# EAGLE design ftdi-485 (EAGLE 6.1)
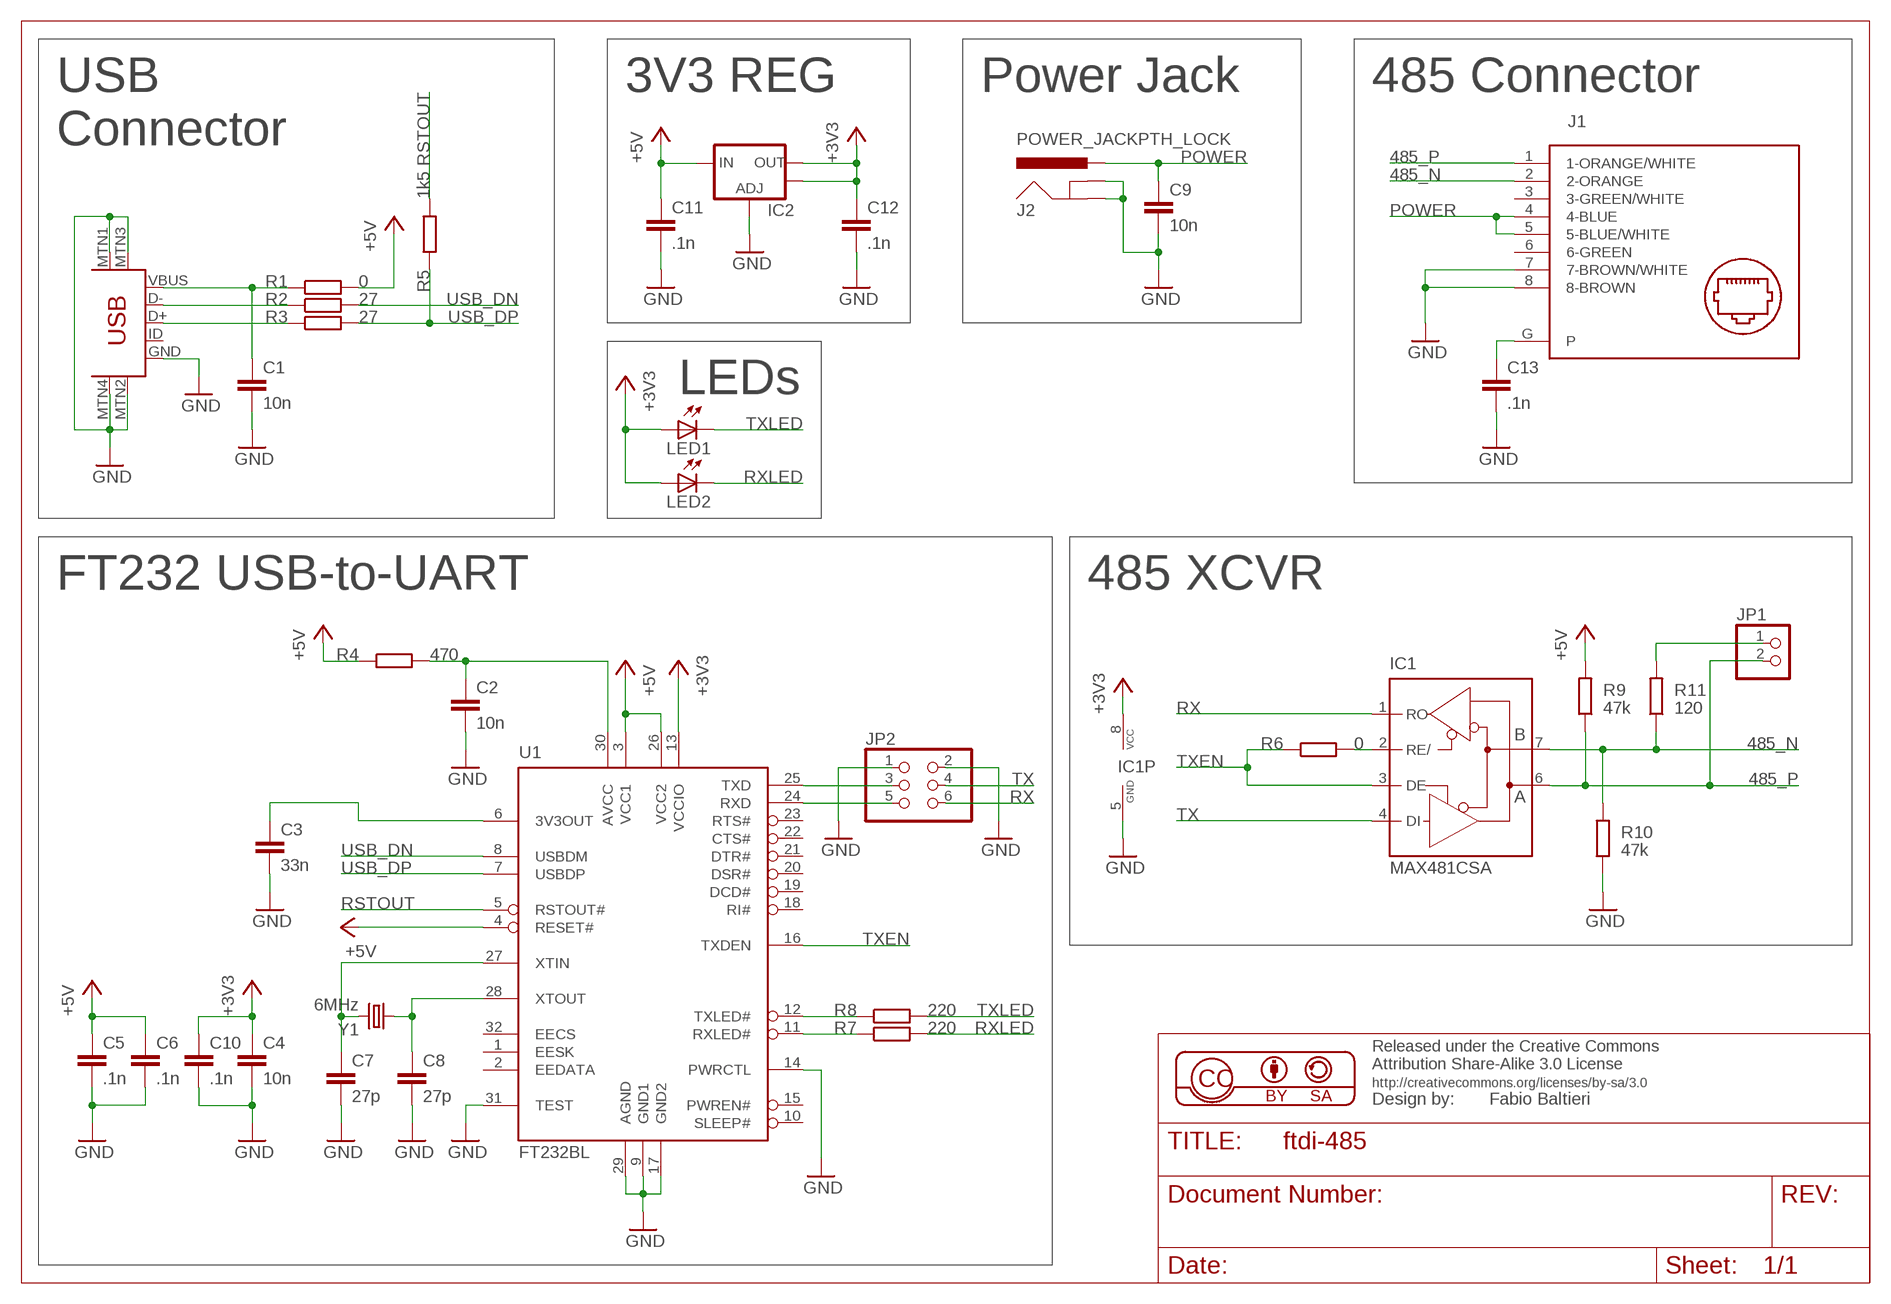
[diagram p0: schematic, sheet 1]

## Parts
C1  10n  C-EUC0805  [C0805]
C2  10n  C-EUC0805  [C0805]
C3  33n  C-EUC0805  [C0805]
C4  10n  C-EUC0805  [C0805]
C5  .1n  C-EUC0805  [C0805]
C6  .1n  C-EUC0805  [C0805]
C7  27p  C-EUC0805  [C0805]
C8  27p  C-EUC0805  [C0805]
C9  10n  C-EUC0805  [C0805]
C10  .1n  C-EUC0805  [C0805]
C11  .1n  C-EUC0805  [C0805]
C12  .1n  C-EUC0805  [C0805]
C13  .1n  C-EUC0805  [C0805]
IC1  MAX481CSA  [SO08]
IC2  V_REG_LM1117SOT223  [SOT223]
J1  NE8FAH  [NE8FAH]
J2  POWER_JACKPTH_LOCK  [POWER_JACK_PTH_LOCK]
JP1  PINHD-1X2  [1X02]
JP2  PINHD-2X3  [2X03]
LED1  LEDCHIP-LED0805  [CHIP-LED0805]
LED2  LEDCHIP-LED0805  [CHIP-LED0805]
R1  0  R-EU_R0603  [R0603]
R2  27  R-EU_R0603  [R0603]
R3  27  R-EU_R0603  [R0603]
R4  470  R-EU_R0603  [R0603]
R5  1k5  R-EU_R0603  [R0603]
R6  0  R-EU_R0603  [R0603]
R7  220  R-EU_R0603  [R0603]
R8  220  R-EU_R0603  [R0603]
R9  47k  R-EU_R0603  [R0603]
R10  47k  R-EU_R0603  [R0603]
R11  120  R-EU_R0603  [R0603]
U1  FT232BL  [LQFP32]
U$2  USB-MINIB-5PIN  [USB-MINIB]
Y1  6MHz  CRYSTALHC49UV  [HC49U-V]

## Nets
485_N: IC1.7(B) J1.2(2-ORANGE) R10.2 R11.1
485_P: IC1.6(A) J1.1(1-ORANGE/WHITE) JP1.2 R9.1
+3V3: C4.1 C10.1 C12.1 IC1.8(VCC) IC2.2(OUT) IC2.4(OUT) LED1.A LED2.A U1.13(VCCIO)
+5V: C5.1 C6.1 C11.1 IC2.3(IN) R1.2 R4.1 R9.2 U1.3(VCC1) U1.4(RESET#) U1.26(VCC2)
GND: C1.2 C2.2 C3.2 C4.2 C5.2 C6.2 C7.2 C8.2 C9.2 C10.2 C11.2 C12.2 C13.2 IC1.5(GND) IC2.1(ADJ) J1.7(7-BROWN/WHITE) J1.8(8-BROWN) J2.GND J2.GNDBREAK JP2.1 JP2.2 R10.1 U1.9(GND1) U1.14(PWRCTL) U1.17(GND2) U1.29(AGND) U1.31(TEST) U$2.GND U$2.MTN1(MTN2) U$2.MTN2(MTN3) U$2.MTN3(MTN1) U$2.MTN4
N$1: C1.1 R1.1 U$2.VBUS
N$2: R2.1 U$2.D-
N$3: R3.1 U$2.D+
N$4: R8.1 U1.12(TXLED#)
N$5: C2.1 R4.2 U1.30(AVCC)
N$6: C3.1 U1.6(3V3OUT)
N$7: C7.1 U1.27(XTIN) Y1.2
N$8: C8.1 U1.28(XTOUT) Y1.1
N$9: R7.1 U1.11(RXLED#)
N$10: IC1.2(RE/) R6.2
N$11: JP1.1 R11.2
N$12: JP2.5 U1.24(RXD)
N$13: JP2.3 U1.25(TXD)
N$14: C13.1 J1.G(P)
POWER: C9.1 J1.4(4-BLUE) J1.5(5-BLUE/WHITE) J2.PWR
RSTOUT: R5.2 U1.5(RSTOUT#)
RX: IC1.1(RO) JP2.6
RXLED: LED2.C R7.2
TX: IC1.4(DI) JP2.4
TXEN: IC1.3(DE) R6.1 U1.16(TXDEN)
TXLED: LED1.C R8.2
USB_DN: R2.2 U1.8(USBDM)
USB_DP: R3.2 R5.1 U1.7(USBDP)
Unconnected: J1.3(3-GREEN/WHITE) J1.6(6-GREEN) U1.1(EESK) U1.2(EEDATA) U1.10(SLEEP#) U1.15(PWREN#) U1.18(RI#) U1.19(DCD#) U1.20(DSR#) U1.21(DTR#) U1.22(CTS#) U1.23(RTS#) U1.32(EECS) U$2.ID

## Notes on the sheet
- USB | 3V3 REG | Power Jack | 485 Connector
- Connector
- LEDs
- FT232 USB-to-UART | 485 XCVR

## Library data of the parts
C1-C13 = rcl:C-EU: CAPACITOR, European symbol
IC1 = maxim:MAX481CSA: RS485 TRANSEIVER
IC2 = sparkfun:V_REG_LM1117: Voltage Regulator LM1117 Standard adjustable voltage regulator but in SMD form. Spark Fun Electronics SKU : COM-00595
J1 = audio:NE8FAH: Ethercon NE8FAH Horizonal PCB mount RJ45 receptacle, A-Series cutout with latch lock, max. panel thickness 3 mm
J2 = sparkfun:POWER_JACK: Power Jack This is the standard 5.5mm barrel jack for power. The PTH is the most common, proven, reliable, footprint. All others are experimental. The Slot footprint only works if the mill layer is transmitted to the PCB fab house so be warned. Spark Fun Electronics SKU : PRT-00119. Mating wall wart : TOL-00298 (and others)
JP1 = pinhead:PINHD-1X2: PIN HEADER
JP2 = pinhead:PINHD-2X3: PIN HEADER
LED1 LED2 = led:LED: LED OSRAM: - CHIPLED LG R971, LG N971, LY N971, LG Q971, LY Q971, LO R971, LY R971 LH N974, LH R974 LS Q976, LO Q976, LY Q976 LO Q996 - Hyper CHIPLED LW Q18S LB Q993, LB Q99A, LB R99A - SideLED LS A670, LO A670, LY A670, LG A670, LP A670 LB A673, LV A673, LT A673, LW A673 LH A674 LY A675 LS A676, LA A676, LO A676, LY A676, LW A676 LS A679, LY A679, LG A679 - Hyper Micro SIDELED® LS Y876, LA Y876, LO Y876, LY Y876 LT Y87S - SmartLED LW L88C, LW L88S LB L89C, LB L89S, LG L890 LS L89K, LO L89K, LY L89K LS L896, LA L896, LO L896, LY L896 - TOPLED LS T670, LO T670, LY T670, LG T670, LP T670 LSG T670, LSP T670, LSY T670, LOP T670, LYG T670 LG T671, LOG T671, LSG T671 LB T673, LV T673, LT T673, LW T673 LH T674 LS T676, LA T676, LO T676, LY T676, LB T676, LH T676, LSB T676, LW T676 LB T67C, LV T67C, LT T67C, LS T67K, LO T67K, LY T67K, LW E67C LS E67B, LA E67B, LO E67B, LY E67B, LB E67C, LV E67C, LT E67C LW T67C LS T679, LY T679, LG T679 LS T770, LO T770, LY T770, LG T770, LP T770 LB T773, LV T773, LT T773, LW T773 LH T774 LS E675, LA E675, LY E675, LS T675 LS T776, LA T776, LO T776, LY T776, LB T776 LHGB T686 LT T68C, LB T68C - Hyper Mini TOPLED® LB M676 - Mini TOPLED Santana® LG M470 LS M47K, LO M47K, LY M47K Source: http://www.osram.convergy.de LUXEON: - LUMILED® LXK2-PW12-R00, LXK2-PW12-S00, LXK2-PW14-U00, LXK2-PW14-V00 LXK2-PM12-R00, LXK2-PM12-S00, LXK2-PM14-U00 LXK2-PE12-Q00, LXK2-PE12-R00, LXK2-PE12-S00, LXK2-PE14-T00, LXK2-PE14-U00 LXK2-PB12-K00, LXK2-PB12-L00, LXK2-PB12-M00, LXK2-PB14-N00, LXK2-PB14-P00, LXK2-PB14-Q00 LXK2-PR12-L00, LXK2-PR12-M00, LXK2-PR14-Q00, LXK2-PR14-R00 LXK2-PD12-Q00, LXK2-PD12-R00, LXK2-PD12-S00 LXK2-PH12-R00, LXK2-PH12-S00 LXK2-PL12-P00, LXK2-PL12-Q00, LXK2-PL12-R00 Source: www.luxeon.com KINGBRIGHT: KA-3528ASYC Source: www.kingbright.com
R1-R11 = rcl:R-EU_: RESISTOR, European symbol
U1 = ftdichip-4:FT232BL: USB UART 2nd Generation USB UART (USB <-> Serial) Controller
U$2 = sparkfun:USB-MINIB: Mini-USB "B" connector with 5th pin broken out. Created new symbol breaking out 5th "ID" pin in mini/micro USB connector spec. See: http://en.wikipedia.org/wiki/Mini_usb#Cables. Uses same footprint as 4-pin symbol. Also added pins to connect to mounting / shield pads if required (probably not generally needed as signals aren't shielded once they leave the connector).
Y1 = sparkfun:CRYSTAL: Crystals Various standard crystals. Proven footprints. Spark Fun Electronics SKU : COM-00534

## Board
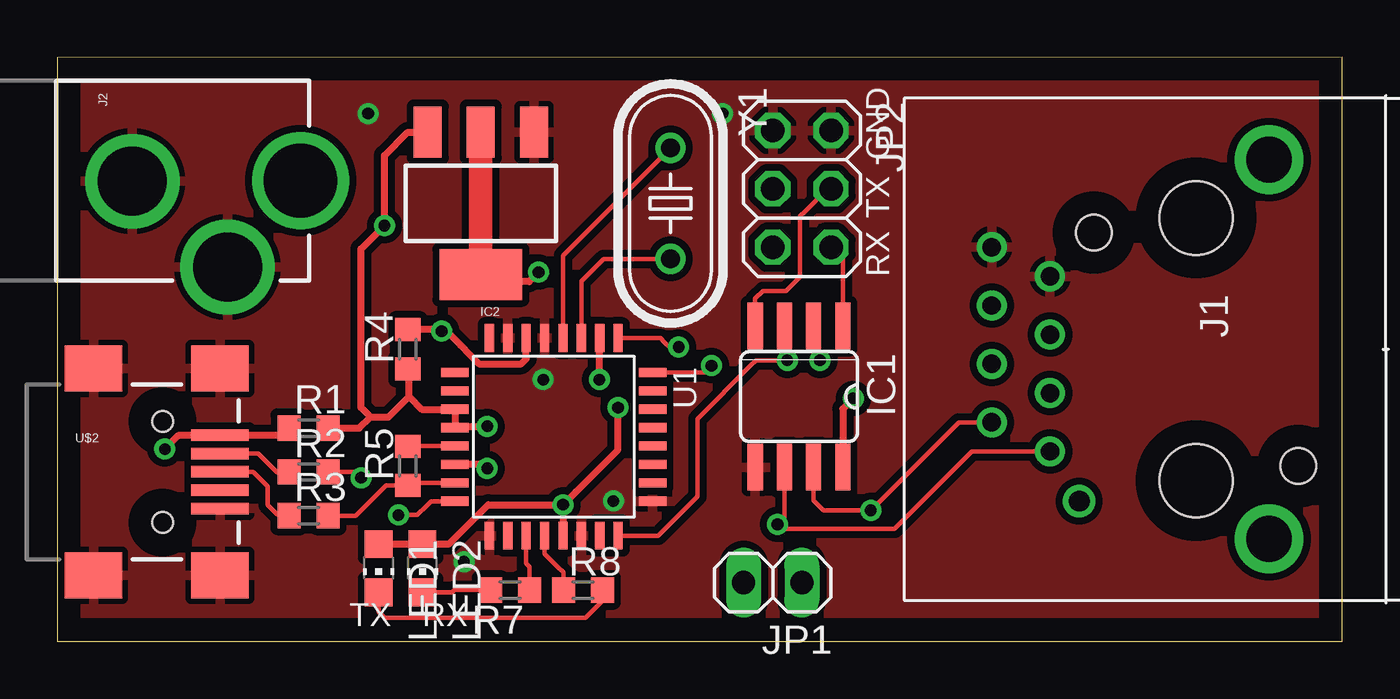
[diagram p1: board, top side]
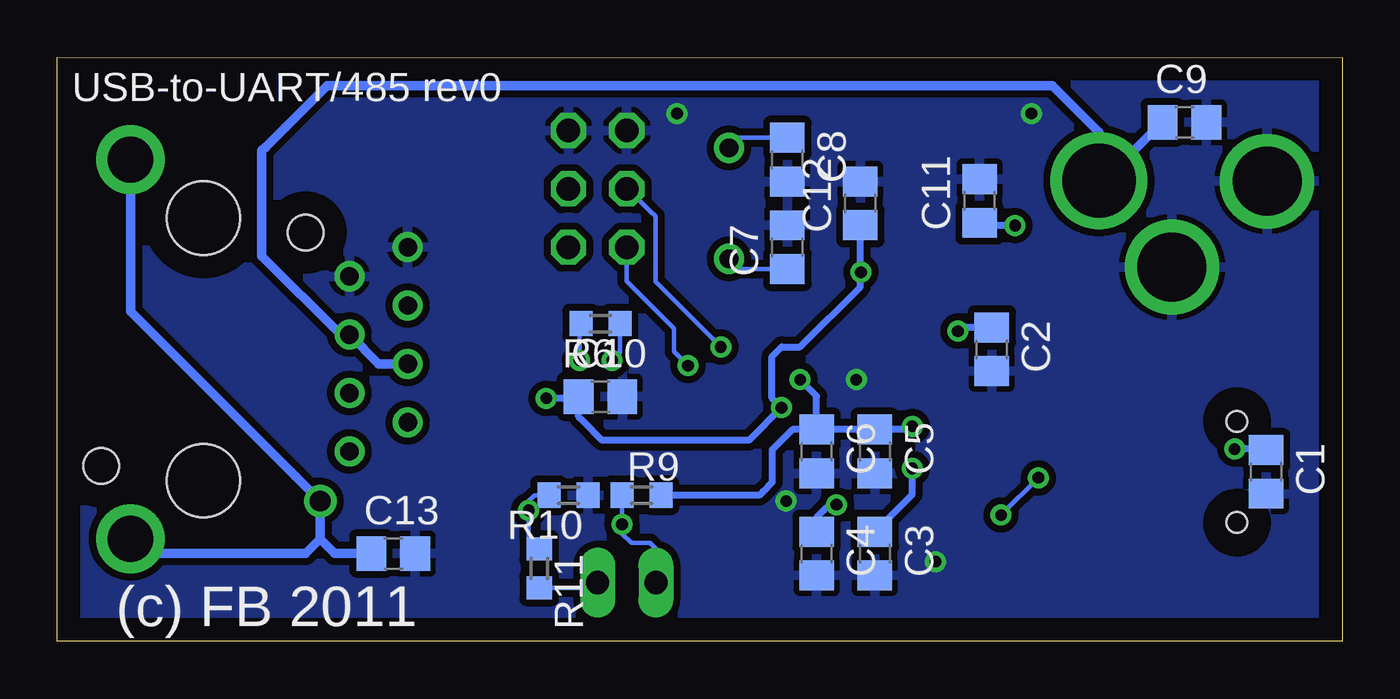
[diagram p2: board, bottom side, seen from below]

Size 55.88 x 25.4 mm. Coordinates in mm from the lower left corner, seen from the top.
Outline: 0,0 55.88,0 55.88,25.4 0,25.39 0,0
Copper layers (1*16): Top 0.035mm / dielectric 1.5mm / Bottom 0.035mm
Design rules: minimum track width 8mil, minimum drill 20mil, track to track 8mil, track to pad 8mil, pad to pad 8mil, via to via 8mil, smd to smd 8mil, copper to edge 40mil, drill to drill 8mil, minimum pad ring 10mil, minimum via ring 8mil, stop-mask expansion 4mil, vias tented up to drill 20mil, thermal gap 10mil
Holes 3.2 mm at 49.53,6.99 49.53,18.41

### Footprints (pad centres in the part's own frame; a part is rotated, then mirrored left to right if it is on the bottom)
C0805 = smd 1.3 x 1.5: 1 -0.95,0; 2 0.95,0
SO08 = smd 0.66 x 2.032: 1 -1.905,-3.073; 2 -0.635,-3.073; 3 0.635,-3.073; 4 1.905,-3.073; 5 1.905,3.073; 6 0.635,3.073; 7 -0.635,3.073; 8 -1.905,3.073
SOT223 = smd 1.219 x 2.235: 1 -2.311,-3.099; 2 0,-3.099; 3 2.311,-3.099 | smd 3.6 x 2.2: 4 0,3.099
NE8FAH = drill 0.8: 1 0,0; 2 -1.27,-2.54; 3 -2.54,0; 4 -3.81,-2.54; 5 -5.08,0; 6 -6.35,-2.54; 7 -7.62,0; 8 -8.89,-2.54 | drill 0.9: G 2.159,1.27 | hole 1.55: -9.525,1.905; 0.635,10.795
POWER_JACK_PTH_LOCK = drill 2.997 pad 4.115: GND 0.025,6.557; GNDBREAK 3.762,10.7 | drill 3.2 pad 4.115: PWR 0,13.878
1X02 = drill 1.016 long: 1 -1.27,0; 2 1.27,0
2X03 = drill 1.016 octagon: 1 -2.54,-1.27; 2 -2.54,1.27; 3 0,-1.27; 4 0,1.27; 5 2.54,-1.27; 6 2.54,1.27
CHIP-LED0805 = smd 1.2 x 1.2: A 0,-1.05; C 0,1.05
R0603 = smd 1 x 1.1: 1 -0.85,0; 2 0.85,0
LQFP32 = smd 0.4 x 1.2: 1 -2.8,-4.3; 2 -2,-4.3; 3 -1.2,-4.3; 4 -0.4,-4.3; 5 0.4,-4.3; 6 1.2,-4.3; 7 2,-4.3; 8 2.8,-4.3; 17 2.8,4.3; 18 2,4.3; 19 1.2,4.3; 20 0.4,4.3; 21 -0.4,4.3; 22 -1.2,4.3; 23 -2,4.3; 24 -2.8,4.3 | smd 1.2 x 0.4: 9 4.3,-2.8; 10 4.3,-2; 11 4.3,-1.2; 12 4.3,-0.4; 13 4.3,0.4; 14 4.3,1.2; 15 4.3,2; 16 4.3,2.8; 25 -4.3,2.8; 26 -4.3,2; 27 -4.3,1.2; 28 -4.3,0.4; 29 -4.3,-0.4; 30 -4.3,-1.2; 31 -4.3,-2; 32 -4.3,-2.8
USB-MINIB = smd 2.5 x 0.5: D+ 2.5,0; D- 2.5,0.8; GND 2.5,-1.6; ID 2.5,-0.8; VBUS 2.5,1.6 | smd 2.5 x 2: MTN1 -3,4.5; MTN2 2.5,4.5; MTN3 -3,-4.5; MTN4 2.5,-4.5 | hole 0.9: 0,2.2; 0,-2.2
HC49U-V = drill 0.813: 1 -2.413,0; 2 2.413,0

### Placement (x,y rotation side)
C1  3.3,7.37 270 bottom
C2  15.24,12.7 270 bottom
C3  20.32,3.81 270 bottom
C4  22.86,3.81 270 bottom
C5  20.32,8.26 270 bottom
C6  22.86,8.26 270 bottom
C7  24.13,17.14 90 bottom
C8  24.13,20.95 270 bottom
C9  6.86,22.58 0 bottom
C10  32.26,10.64 0 bottom
C11  15.77,19.15 90 bottom
C12  20.95,19.05 90 bottom
C13  41.27,3.81 0 bottom
IC1  32.26,10.64 180 top
IC2  18.41,19.05 180 top
J1  43.18,8.26 270 top
J2  -3.3,20.04 270 top
JP1  31.11,2.54 180 top
JP2  32.38,19.68 270 top
LED1  13.97,3.17 180 top
LED2  15.88,3.17 180 top
R1  10.92,9.27 0 top
R2  10.92,7.37 0 top
R3  10.92,5.46 0 top
R4  15.24,12.7 90 top
R5  15.24,7.62 90 top
R6  32.26,13.82 180 bottom
R7  19.68,2.22 180 top
R8  22.86,2.22 0 top
R9  30.48,6.35 0 bottom
R10  33.66,6.35 180 bottom
R11  34.92,3.17 270 bottom
U1  21.59,8.89 270 top
U$2  4.57,7.37 0 top
Y1  26.67,19.05 270 top

### Tracks (layer width: path | path; a pad name or v marks a point on that pad's centre or on a via)
485_N  (via drill 0.51)
  Top 0.203: J1.2 39.22,9.53 v35.38,5.69 33.33,5.69 33.12,5.89 32.89,6.12 IC1.7
  Bottom 0.203: R11.1 35.38,4.48 v35.38,5.69 35.38,6.1 35.18,6.3 35.13,6.35 R10.2
485_P  (via drill 0.51)
  Top 0.203: J1.1 39.78,8.26 38.43,6.91 36.4,4.88 31.52,4.88 v31.32,5.08 31.62,5.38 IC1.6
  Bottom 0.203: R9.1 31.32,6.34 v31.32,5.08 31.32,4.67 30.91,4.27 30.1,4.27 29.84,4.01 JP1.2
+3V3  (via drill 0.51)
  Top 0.305: IC1.8 34.16,10.11 v34.62,10.57 | v24.38,10.16 24.38,8.33 22.55,6.5 v21.99,5.94 | v21.99,5.94 U1.13 | v21.99,5.94 18.74,5.94 17.27,4.47 17.03,4.22 LED2.A LED1.A | 20.73,15.85 v20.93,16.05 20.52,15.65 18.9,15.65 18.59,15.95 IC2.4
  Top 1.016: IC2.4 IC2.2
  Bottom 0.305: v34.62,10.57 33.28,10.57 C10.1 33.21,9.76 32.99,9.55 32.18,8.74 25.81,8.74 v24.38,10.16 24.79,10.57 24.79,12.39 24.38,12.8 23.57,12.8 20.95,15.42 20.95,16.08 | 22.86,5.07 C4.1 22.86,5.38 22.55,5.69 22.31,5.94 v21.99,5.94 | C12.1 20.95,16.43 20.95,16.08 | 20.95,16.08 v20.93,16.05
+5V  (via drill 0.51)
  Top 0.305: 15.29,10.64 15.84,10.09 U1.3 U1.4 17.35,9.35 v18.69,9.35 | 15.29,10.64 15.29,11.8 R4.1 | R1.2 13.13,9.27 13.61,9.75 | 15.29,10.64 14.4,9.75 13.61,9.75 | 13.61,9.75 13.21,10.16 13.21,15.24 13.21,17.07 v14.22,18.09 14.22,21.13 15.24,22.15 IC2.3 | U1.26 23.59,11.4 v23.57,11.38
  Bottom 0.305: 18.9,9.35 v18.69,9.35 18.84,9.21 C5.1 C6.1 | C6.1 23.92,9.21 24.79,8.33 24.79,6.91 25.2,6.5 25.35,6.35 R9.2 | C6.1 22.86,10.67 v23.57,11.38 | 14.63,18.09 v14.22,18.09 14.83,18.09 15.66,18.09 C11.1
GND  (via drill 0.51)
  other vias: 17.68,3.45 21.13,11.38 13.51,22.96 28.93,22.96 24.18,6.1
  pour Top (isolate 0.305): 0,0 55.88,0 55.88,25.4 0,25.4
  pour Bottom (isolate 0.305): 0,0 55.88,0 55.88,25.4 0,25.4
N$1  (via drill 0.51)
  Top 0.305: R1.1 9.77,8.97 U$2.VBUS 5.28,8.97 v4.67,8.36
  Bottom 0.305: v4.67,8.36 3.34,8.36 C1.1
N$2
  Top 0.203: U$2.D- 8.72,8.17 9.55,7.34 10.05,7.34 R2.1
N$3
  Top 0.203: U$2.D+ 8.51,7.37 9.14,6.73 9.14,5.92 9.55,5.51 10.02,5.51 R3.1
N$4
  Top 0.203: U1.12 21.19,3.8 21.74,3.25 22.01,2.98 R8.1
N$5  (via drill 0.51)
  Top 0.305: R4.2 16.65,13.55 v16.71,13.49 16.92,13.49 17.53,12.88 17.93,12.47 18.34,12.06 20.17,12.06 20.39,12.29 U1.30
  Bottom 0.305: C2.1 16.55,13.65 v16.71,13.49
N$6  (via drill 0.51)
  Top 0.305: U1.6 18.52,7.69 v18.69,7.52
  Bottom 0.305: v18.69,7.52 18.69,6.39 C3.1
N$7
  Top 0.203: Y1.2 23.75,16.64 22.96,15.85 22.79,15.68 U1.27
  Bottom 0.203: C7.1 26.23,16.2 Y1.2
N$8
  Top 0.203: U1.28 21.99,16.78 Y1.1
  Bottom 0.203: C8.1 26.23,21.91 Y1.1
N$9
  Top 0.203: U1.11 20.39,3.38 20.52,3.25 20.54,3.24 R7.1
N$10  (via drill 0.51)
  Top 0.203: IC1.2 32.89,12.5 v33.17,12.22
  Bottom 0.203: v33.17,12.22 33.17,13.75 R6.2
N$11
  Bottom 0.203: R11.2 32.6,2.33 JP1.1
N$12  (via drill 0.51)
  Top 0.203: 28.25,11.79 v28.45,11.99 28.15,11.69 U1.24
  Bottom 0.203: JP2.5 31.11,15.67 29.06,13.61 29.06,12.6 v28.45,11.99
N$13  (via drill 0.51)
  Top 0.203: v27.03,12.8 26.62,12.8 26.42,13.01 26.23,13.19 U1.25
  Bottom 0.203: JP2.3 31.06,19.68 30.07,18.69 29.87,18.49 29.87,15.65 v27.03,12.8
N$14  (via drill 2)
  Bottom 0.406: 44.45,4.45 J1.G 45.53,7.18 | 44.45,4.45 43.81,3.81 C13.1 | 45.53,7.18 45.72,7.37 | v52.7,4.45 52.07,3.81 45.09,3.81 44.45,4.45 | v52.7,20.95 52.7,14.35 45.53,7.18
POWER
  Bottom 0.406: J1.4 41.91,12.06 J1.5 43.56,13.34 46.99,16.76 46.99,21.34 46.8,21.53 | 46.8,21.53 45.97,22.35 | 46.8,21.53 44.15,24.18 43.1,24.18 12.6,24.18 10.58,22.16 J2.PWR 10.35,20.04 C9.1
RSTOUT
  Top 0.203: U1.5 15.26,8.49 R5.2
RX
  Top 0.203: IC1.1 34.16,16.64 JP2.6
RXLED
  Top 0.203: LED2.C 16.96,2.12 17.16,2.12 17.27,2.23 18.82,2.23 R7.2
TX
  Top 0.203: IC1.4 30.35,14.91 30.68,15.24 31.7,15.24 32.31,15.85 32.31,18.49 32.51,18.69 33.5,19.68 JP2.4
TXEN  (via drill 0.51)
  Top 0.203: IC1.3 31.62,12.34 v31.75,12.22 30.38,12.22 30.15,11.99 27.84,9.68 27.84,6.3 26.21,4.67 26.13,4.59 U1.16
  Bottom 0.203: R6.1 31.41,12.56 v31.75,12.22
TXLED
  Top 0.203: LED1.C 13.97,1.27 14.22,1.02 22.96,1.02 23.71,1.76 R8.2
USB_DN  (via drill 0.51)
  Top 0.203: R2.2 12.95,7.37 v13.21,7.11 | v14.83,5.49 15.65,5.49 16.05,5.89 16.25,6.09 U1.8
  Bottom 0.203: v13.21,7.11 v14.83,5.49
USB_DP
  Top 0.203: U1.7 15.36,6.89 R5.1 14.29,6.77 13.01,5.49 12.98,5.46 R3.2

### Text on the board
_tsilk: GND | TX | RX | TX | RX
_bsilk: USB-to-UART/485 rev0 | (c) FB 2011